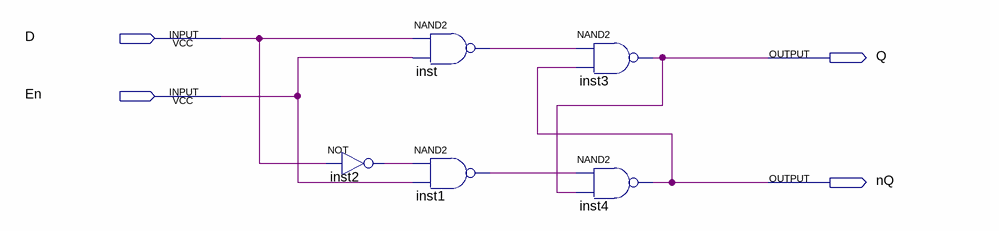
[diagram p0: schematic sheet]
// Quartus schematic D_SR.bdf as structural Verilog: 5 symbols, 4 pins
module D_SR (
  input  D,
  input  En,
  output Q,
  output nQ
);

  wire inst1_out, inst2_out, inst_out;

  not inst2 (inst2_out, D);
  nand inst (inst_out, D, En);
  nand inst1 (inst1_out, inst2_out, En);
  nand inst3 (Q, inst_out, nQ);
  nand inst4 (nQ, inst1_out, Q);
endmodule
